# EAGLE design GadgetBox-Mini-Pro-Clone-Modules (EAGLE 6.6.0)

## Sheet 1 of 2
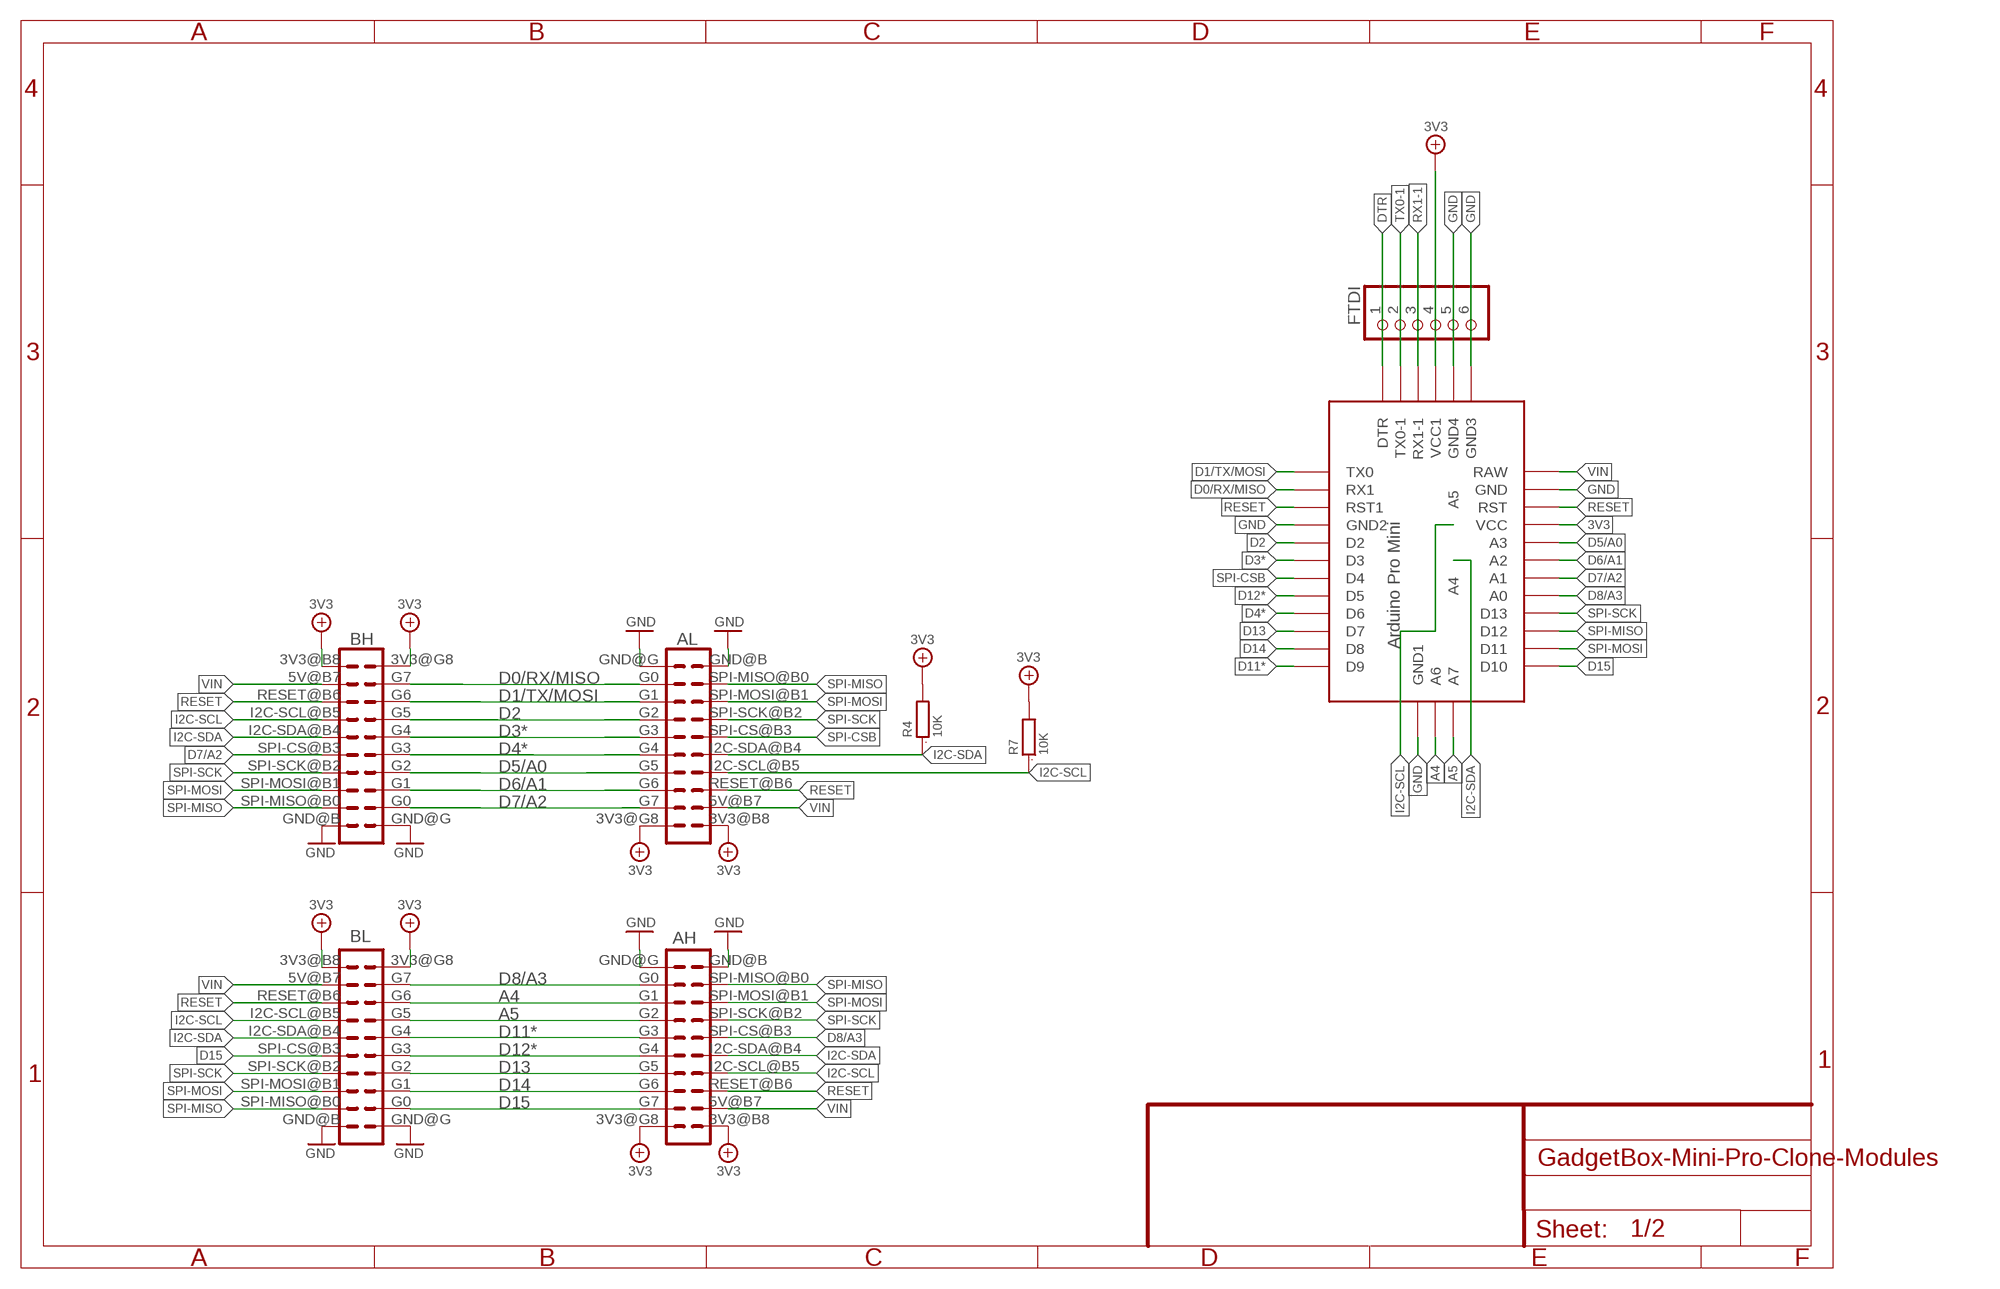
[diagram p0: schematic, sheet 1]

### Parts
AH  ECOGECOG_SLOT_ALT1  [ECOG_ALT1]
AL  ECOGECOG_SLOT_ALT1  [ECOG_ALT1]
BH  ECOGECOG_SLOT_ALT1  [ECOG_ALT1]
BL  ECOGECOG_SLOT_ALT1  [ECOG_ALT1]
FTDI  PINHD-1X6  [1X06]
R4  10K  R0603  [0603]
R7  10K  R0603  [0603]
U$1  ABK-PRO-MINI  [ABK-PRO-MINI]

### Nets
3V3: AH.3V3@B8(3V3) AH.3V3@G8(3V3) AL.3V3@B8(3V3) AL.3V3@G8(3V3) BH.3V3@B8(3V3) BH.3V3@G8(3V3) BL.3V3@B8(3V3) BL.3V3@G8(3V3) FTDI.4 R4.2 R7.2 U$1.VCC U$1.VCC11(VCC1)
A4: AH.G1 BL.G6 U$1.A6
A5: AH.G2 BL.G5 U$1.A7
D0/RX/MISO: AL.G0 BH.G7 U$1.RX1
D1/TX/MOSI: AL.G1 BH.G6 U$1.TX0
D2: AL.G2 BH.G5 U$1.D2
D3*: AL.G3 BH.G4 U$1.D3
D4*: AL.G4 BH.G3 U$1.D6
D5/A0: AL.G5 BH.G2 U$1.A3 ; also sheet 2
D6/A1: AL.G6 BH.G1 U$1.A2
D7/A2: AL.G7 BH.G0 BH.SPI-CS@B3(SPI-CS) U$1.A1
D8/A3: AH.G0 AH.SPI-CS@B3(SPI-CS) BL.G7 U$1.A0
D11*: AH.G3 BL.G4 U$1.D9
D12*: AH.G4 BL.G3 U$1.D5
D13: AH.G5 BL.G2 U$1.D7
D14: AH.G6 BL.G1 U$1.D8
D15: AH.G7 BL.G0 BL.SPI-CS@B3(SPI-CS) U$1.D10
DTR: FTDI.1 U$1.DTR
GND [gnd]: AH.GND@B(GND) AH.GND@G(GND) AL.GND@B(GND) AL.GND@G(GND) BH.GND@B(GND) BH.GND@G(GND) BL.GND@B(GND) BL.GND@G(GND) FTDI.5 FTDI.6 U$1.GND U$1.GND1 U$1.GND2 U$1.GND3 U$1.GND4 ; also sheet 2
I2C-SCL: AH.I2C-SCL@B5(I2C-SCL) AL.I2C-SCL@B5(I2C-SCL) BH.I2C-SCL@B5(I2C-SCL) BL.I2C-SCL@B5(I2C-SCL) R7.1 U$1.A5
I2C-SDA: AH.I2C-SDA@B4(I2C-SDA) AL.I2C-SDA@B4(I2C-SDA) BH.I2C-SDA@B4(I2C-SDA) BL.I2C-SDA@B4(I2C-SDA) R4.1 U$1.A4
RESET: AH.RESET@B6(RESET) AL.RESET@B6(RESET) BH.RESET@B6(RESET) BL.RESET@B6(RESET) U$1.RST U$1.RST1
RX1-1: FTDI.3 U$1.RX1-1
SPI-CSB: AL.SPI-CS@B3(SPI-CS) U$1.D4
SPI-MISO: AH.SPI-MISO@B0(SPI-MISO) AL.SPI-MISO@B0(SPI-MISO) BH.SPI-MISO@B0(SPI-MISO) BL.SPI-MISO@B0(SPI-MISO) U$1.D12
SPI-MOSI: AH.SPI-MOSI@B1(SPI-MOSI) AL.SPI-MOSI@B1(SPI-MOSI) BH.SPI-MOSI@B1(SPI-MOSI) BL.SPI-MOSI@B1(SPI-MOSI) U$1.D11
SPI-SCK: AH.SPI-SCK@B2(SPI-SCK) AL.SPI-SCK@B2(SPI-SCK) BH.SPI-SCK@B2(SPI-SCK) BL.SPI-SCK@B2(SPI-SCK) U$1.D13
TX0-1: FTDI.2 U$1.TX0-1
VIN: AH.5V@B7(5V) AL.5V@B7(5V) BH.5V@B7(5V) BL.5V@B7(5V) U$1.RAW ; also sheet 2

## Sheet 2 of 2
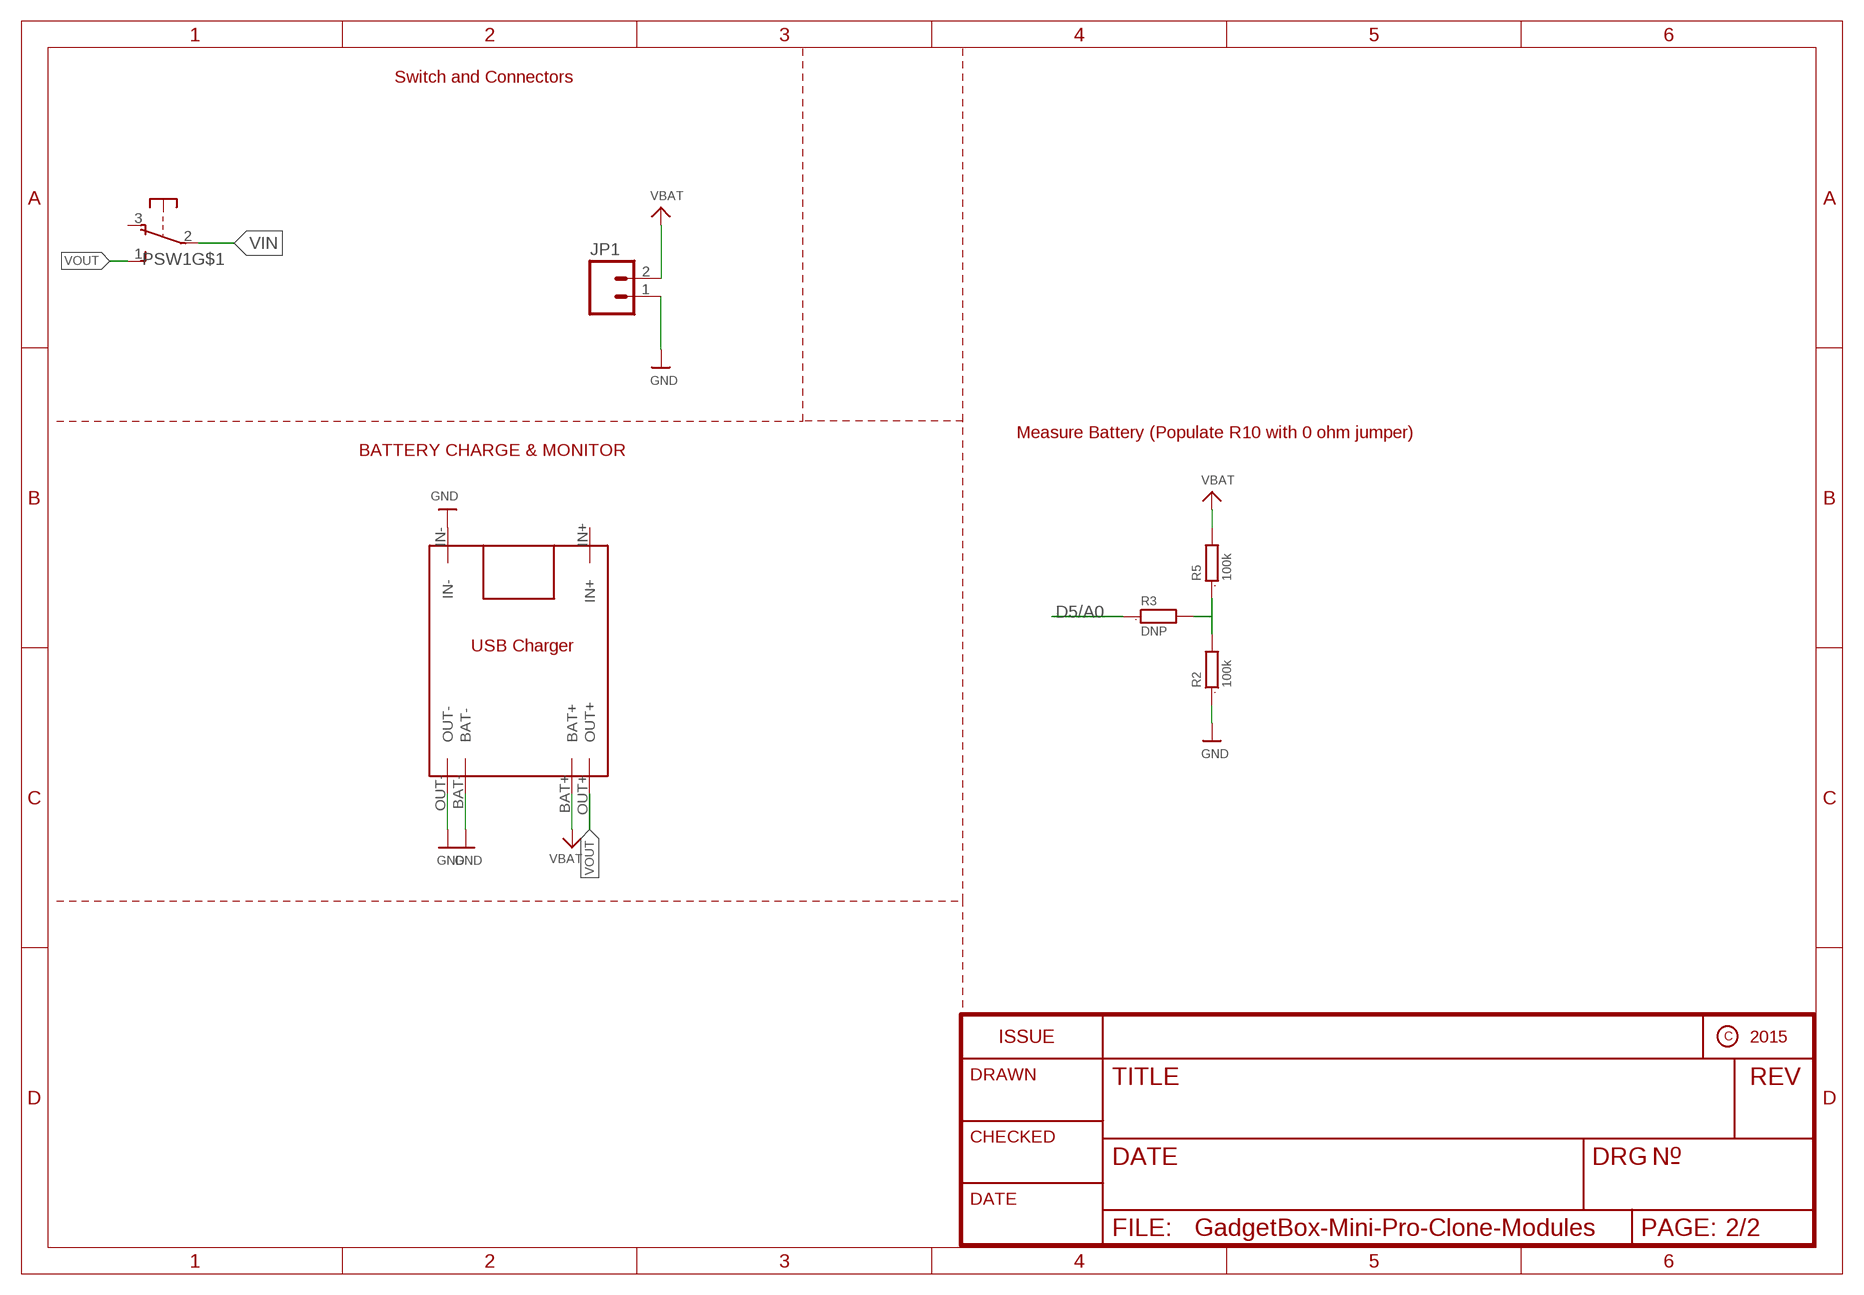
[diagram p1: schematic, sheet 2]

### Parts
JP1  M02-JST-2-PTH-NO_SILK  [JST-2-PTH-NS]
PSW1  OS102011MA1Q  [OS102011MA1Q]
R2  100k  R0603  [0603]
R3  DNP  R0603  [0603]
R5  100k  R0603  [0603]
U$5  TP4056  [TP4056]

### Nets
D5/A0: R3.1 ; also sheet 1
GND [gnd]: JP1.1 R2.1 U$5.BAT- U$5.IN- U$5.OUT- ; also sheet 1
N$2: R2.2 R3.2 R5.1
VBAT: JP1.2 R5.2 U$5.BAT+
VIN: PSW1.2(P) ; also sheet 1
VOUT: PSW1.1(S) U$5.OUT+
Unconnected: PSW1.3(O) PSW1.MT1(MT) PSW1.MT2(MT) U$5.IN+

### Notes on the sheet
- Switch and Connectors
- Measure Battery (Populate R10 with 0 ohm jumper)
- BATTERY CHARGE & MONITOR

## Library data of the parts
AH AL BH BL = eCogs:ECOG; PARTNO: PPPC102LFBN-RC,SULLINS CONNECTOR SOLUTIONS,dk,S6106-ND,"CONN HEADER FEM 20POS.1"" DL GOLD", REF67
FTDI = GadgetFactory:PINHD-1X6: PIN HEADER; PARTNO: PPPC061LGBN-RC,SULLINS CONNECTOR SOLUTIONS,dk,S5481-ND ,"6 Position Header Connector 0.100"" (2.54mm) Through Hole - Right Angle Gold ", REF91
JP1 = SparkFun:M02: Header 2 Standard 2-pin 0.1" header. Use with straight break away headers (SKU : PRT-00116), right angle break away headers (PRT-00553), swiss pins (PRT-00743), machine pins (PRT-00117), and female headers (PRT-00115). Molex polarized connector foot print use with SKU : PRT-08233 with associated crimp pins and housings.; PARTNO: B2B-PH-SM4-TB(LF)(SN),JST SALES AMERICA INC (VA),dk,455-1734-1-ND ,"2 Positions Header, Shrouded Connector 0.079 (2.00mm) Through Hole Tin ", REF87
PSW1 = adafruit:OS102011MA1Q: OS10201MA1Q through-hole right angle switch http://www.ladyada.net/library/eagle; PARTNO: OS102011MA1QN1,C&K Components,dk,CKN9559-ND,SWITCH SLIDE SPDT 100MA 12V , REF72
R2 R5 = GadgetFactory:R: RESISTOR, European symbol; PARTNO: RC0603JR-07100KL,YAGEO (VA),dk,311-100KGRCT-ND,RES SMD 100K OHM 5% 1/10W 0603 , REF76
R3 = GadgetFactory:R: RESISTOR, European symbol; BOM: EXCLUDE
R4 R7 = GadgetFactory:R: RESISTOR, European symbol; PARTNO: RC0603JR-0710KL,YAGEO (VA),dk,311-10KGRCT-ND,RES SMD 10K OHM 5% 1/10W 0603 , REF36
U$1 = Arduino-clone:ABK-PRO-MINI: ABK Pro-Mini Arduino Clone; BOM: EXCLUDE
U$5 = TP4056 charging module:TP4056

## Net classes
2 gnd: width 0.254 mm, drill 0.381 mm, clearance 0.254 mm
3 usbvcc: width 0.254 mm, drill 0.381 mm, clearance 0.254 mm
4 aref: width 0.254 mm, drill 0.381 mm, clearance 0.254 mm

## Board
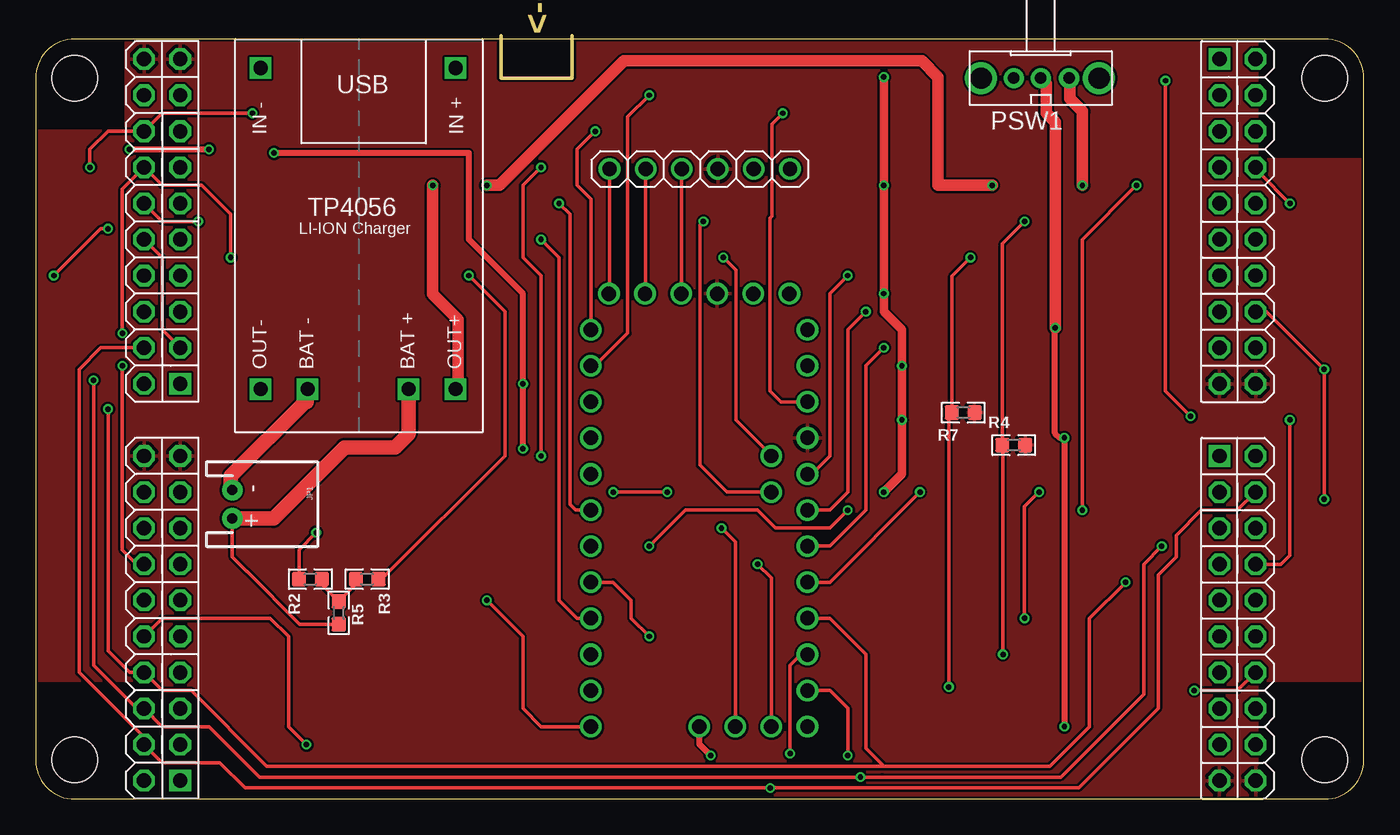
[diagram p2: board, top side]
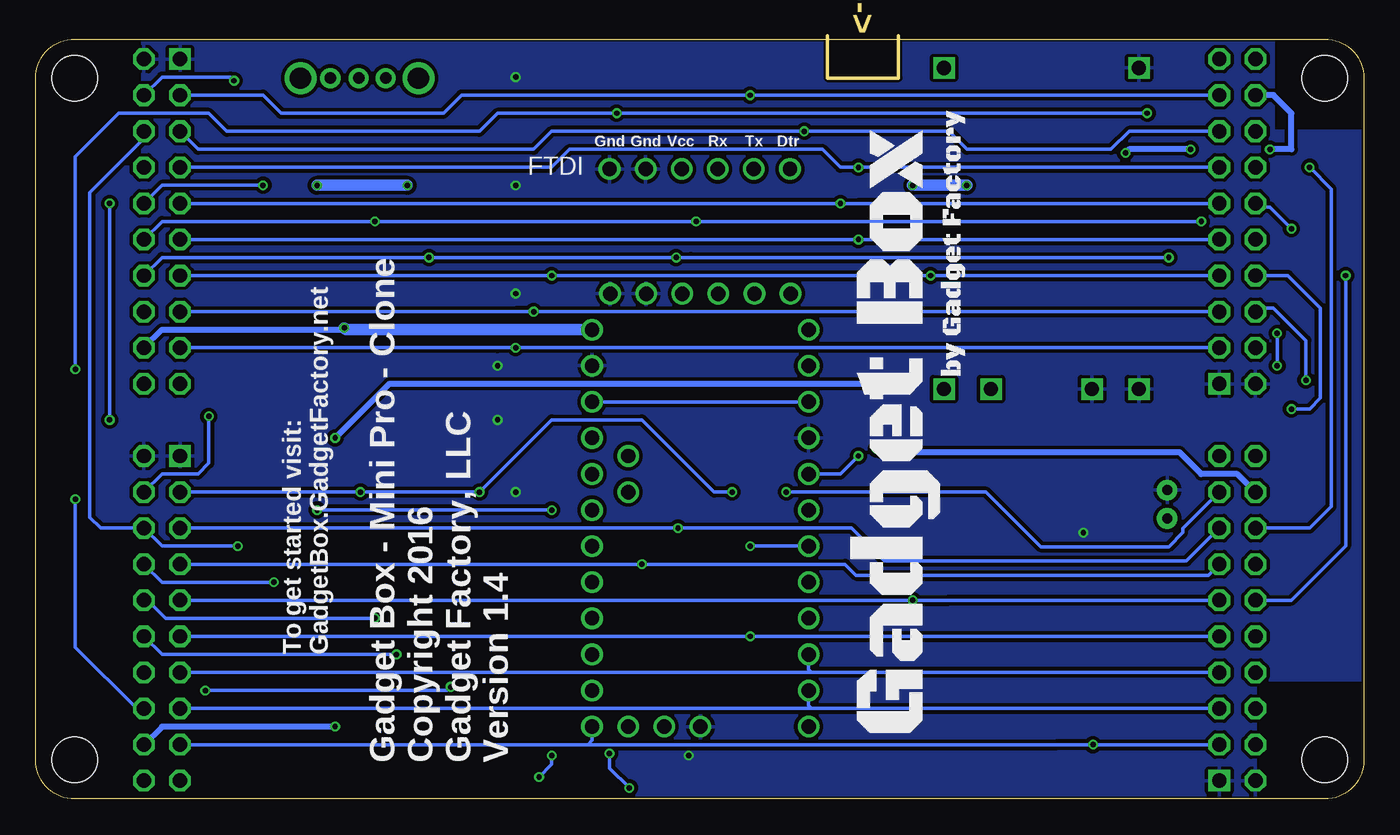
[diagram p3: board, bottom side, seen from below]

Size 93.5 x 53.75 mm. Coordinates in mm from the lower left corner, seen from the top.
Outline: 37.75,53.75 37.75,50.75 32.75,50.75 32.75,53.75
Copper layers (1*16): Top 0.035mm / dielectric 1.5mm / Bottom 0.035mm
Design rules "hackvana *": minimum track width 6mil, minimum drill 0.3mm, track to track 6mil, track to pad 6mil, pad to pad 6mil, via to via 6mil, smd to smd 0mil, copper to edge 6mil, drill to drill 6mil, minimum pad ring 10mil, minimum via ring 6mil, stop-mask expansion 2mil, vias tented up to drill 100mil, thermal gap 10mil

### Footprints (pad centres in the part's own frame; a part is rotated, then mirrored left to right if it is on the bottom)
ECOG93P53P5 = hole 3.2: 4,4; 92,4; 92,52; 4,52
ECOG_ALT1 = drill 1.016 octagon: 3V3@B8 21.59,3.81; 3V3@G8 21.59,1.27; 5V@B7 19.05,3.81; G0 1.27,1.27; G1 3.81,1.27; G2 6.35,1.27; G3 8.89,1.27; G4 11.43,1.27; G5 13.97,1.27; G6 16.51,1.27; G7 19.05,1.27; GND@B -1.27,3.81; I2C-SCL@B5 13.97,3.81; I2C-SDA@B4 11.43,3.81; RESET@B6 16.51,3.81; SPI-CS@B3 8.89,3.81; SPI-MISO@B0 1.27,3.81; SPI-MOSI@B1 3.81,3.81; SPI-SCK@B2 6.35,3.81 | drill 1.016 square: GND@G -1.27,1.27
1X06 = drill 1.016: 1 -6.35,0; 2 -3.81,0; 3 -1.27,0; 4 1.27,0; 5 3.81,0; 6 6.35,0
JST-2-PTH-NS = drill 0.7 pad 1.448: 1 -1,0; 2 1,0
OS102011MA1Q = drill 0.8 pad 1.422: 1 -2,0; 2 0,0; 3 1.9,0 | drill 1.5 pad 2.184: MT1 -4.1,0; MT2 4.2,0
0603 = smd 1 x 1: 1 -0.8,0; 2 0.8,0
ABK-PRO-MINI = drill 1.016: A0 10.16,-11.43; A1 10.16,-8.89; A2 10.16,-6.35; A3 10.16,-3.81; A4 7.62,-5.08; A5 7.62,-2.54; A6 5.08,-21.59; A7 7.62,-21.59; D2 -5.08,-3.81; D3 -5.08,-6.35; D4 -5.08,-8.89; D5 -5.08,-11.43; D6 -5.08,-13.97; D7 -5.08,-16.51; D8 -5.08,-19.05; D9 -5.08,-21.59; D10 10.16,-21.59; D11 10.16,-19.05; D12 10.16,-16.51; D13 10.16,-13.97; DTR -3.81,8.89; GND 10.16,3.81; GND1 -5.08,-1.27; GND2 8.89,8.89; GND3 6.35,8.89; GND4 2.54,-21.59; RAW 10.16,6.35; RST 10.16,1.27; RST1 -5.08,1.27; RX1 -5.08,3.81; RX1-1 1.27,8.89; TX0 -5.08,6.35; TX0-1 -1.27,8.89; VCC 10.16,-1.27; VCC11 3.81,8.89
TP4056 = drill 1 pad 1.422 square: BAT+ 3.505,-8.89; BAT- -3.607,-8.89; IN+ 6.807,13.716; IN- -6.909,13.716; OUT+ 6.807,-8.89; OUT- -6.909,-8.89

### Placement (x,y rotation side)
$$U$1  [ECOG93P53P5]  -1.25,-1.25 0 top
AH  82.06,22.88 270 top
AL  82.06,50.82 270 top
BH  11.45,30.5 90 top
BL  11.45,2.56 90 top
FTDI  46.75,44.35 0 top
JP1  13.85,20.75 270 top
PSW1  70.75,50.75 180 top
R2  19.34,15.48 0 top
R3  23.34,15.48 180 top
R4  68.85,24.91 0 top
R5  21.34,13.1 270 top
R7  65.3,27.2 0 top
U$1  44.17,26.69 0 top
U$5  22.75,37.75 0 top
U$100  [GADGETBOX_TEXT]  32.79,25.93 90 bottom

### Tracks (layer width: path | path; a pad name or v marks a point on that pad's centre or on a via)
3V3
  pour Top: -1.25,8.37 -1.25,47.03 6.37,47.03 6.37,54.63 85.95,54.63 85.95,45.01 94.92,45.01 94.92,8.37 85.95,8.37 85.95,-1.25 7.64,-1.25 7.64,8.37
A4  (via drill 0.38)
  Top 0.254: U$1.A6 49.25,18.1 v48.28,19.07
  Bottom 0.254: AH.G1 v48.28,19.07 36.07,19.07 33.75,16.75 12.5,16.75 BL.G6
A5  (via drill 0.38)
  Top 0.254: U$1.A7 51.79,15.56 v50.82,16.53
  Bottom 0.254: AH.G2 v50.82,16.53 36.53,16.53 35.75,15.75 10.96,15.75 BL.G5
D0/RX/MISO  (via drill 0.38)
  Top 0.254: U$1.RX1 39.39,30.5 41.68,32.79 41.68,48.03 v43.2,49.55
  Bottom 0.254: AL.G0 77.49,49.55 76.22,48.28 64.79,48.28 63.52,49.55 44.47,49.55 v43.2,49.55 BH.G7
D1/TX/MOSI  (via drill 0.38)
  Top 0.254: U$1.TX0 39.09,42.23 38.12,43.2 38.12,45.74 v39.39,47.01
  Bottom 0.254: BH.G6 16.53,47.01 17.8,45.74 27.96,45.74 29.23,47.01 v39.39,47.01 57.17,47.01 58.44,45.74 82.06,45.74 AL.G1
D2  (via drill 0.38)
  Top 0.254: v35.58,24.15 35.58,36.85 34.31,38.12 34.31,43.2 v35.58,44.47
  Bottom 0.254: AL.G2 57.17,44.47 55.9,45.74 38.12,45.74 36.85,44.47 v35.58,44.47 BH.G5 | U$1.D2 36.85,22.88 v35.58,24.15
D3*  (via drill 0.38)
  Top 0.254: U$1.D3 37.99,20.34 37.61,20.72 37.61,41.17 v36.85,41.93
  Bottom 0.254: BH.G4 35.58,41.93 v36.85,41.93 AL.G3
D4*  (via drill 0.38)
  Top 0.254: U$1.D6 38.12,12.72 36.85,13.99 36.85,38.12 v35.58,39.39
  Bottom 0.254: AL.G4 v35.58,39.39 34.31,39.39 BH.G3
D5/A0  (via drill 0.38)
  Top 0.254: U$1.A3 54.63,22.88 55.9,24.15 55.9,35.58 v57.17,36.85 | R3.1 24.37,15.48 33.04,24.15 33.04,34.31 v30.5,36.85
  Bottom 0.254: AL.G5 v57.17,36.85 v30.5,36.85 29.23,36.85 BH.G2
D6/A1  (via drill 0.38)
  Top 0.254: U$1.A2 55.9,20.34 57.17,21.61 57.17,33.04 v58.44,34.31
  Bottom 0.254: AL.G6 59.71,34.31 v58.44,34.31 BH.G1
D7/A2  (via drill 0.38)
  Top 0.254: U$1.A1 55.9,17.8 58.44,20.34 58.44,30.5 v59.71,31.77 | BH.G0 8.91,33.04 8.91,38.12 BH.SPI-CS@B3
  Bottom 0.254: BH.G0 v59.71,31.77 60.98,31.77 AL.G7
D8/A3  (via drill 0.38)
  Top 0.254: v69.62,12.72 69.62,20.59 v70.63,21.61 | U$1.A0 55.9,15.26 v62.25,21.61 | v40.66,21.61 v44.47,21.61
  Bottom 0.254: AH.G0 v70.63,21.61 v62.25,21.61 57.17,26.69 50.82,26.69 45.74,21.61 v44.47,21.61 | AH.SPI-CS@B3 85.62,13.99 84.35,12.72 v69.62,12.72 | v40.66,21.61 26.61,21.61 22.75,17.75 13.75,17.75 12.75,18.75 12.75,19.04 BL.G7
D11*  (via drill 0.38)
  Top 0.254: U$1.D9 35.58,5.1 34.31,6.37 34.31,11.45 v31.77,13.99
  Bottom 0.254: BL.G4 29.23,13.99 v31.77,13.99 AH.G3
D12*  (via drill 0.38)
  Top 0.254: U$1.D5 40.66,15.26 41.93,13.99 41.93,12.72 v43.2,11.45
  Bottom 0.254: AH.G4 44.47,11.45 v43.2,11.45 BL.G3
D13
  Bottom 0.254: BL.G2 38.88,8.91 | 38.88,8.91 AH.G5 | U$1.D7 39.09,9.12 38.88,8.91
D14
  Bottom 0.254: AH.G6 38.88,6.37 | 38.88,6.37 BL.G1 | U$1.D8 39.09,6.58 38.88,6.37
D15  (via drill 0.38)
  Top 0.254: BL.SPI-CS@B3 8.91,12.72 16.53,12.72 17.8,11.45 17.8,5.1 v19.07,3.83
  Bottom 0.254: AH.G7 54.63,3.83 | 54.63,3.83 21.61,3.83 v19.07,3.83 BL.G0 | U$1.D10 54.33,4.13 54.63,3.83
DTR
  Top 0.254: FTDI.1 40.4,35.62 U$1.DTR
GND  (via drill 0.38)
  Top 0.254: R2.1 18.54,17.54 v19.75,18.75
  Top 0.406: U$1.GND4 46.71,3.88 v47.52,3.07
  Top 0.61: v59.71,50.82 v59.71,43.2 v59.71,35.58 59.71,34.31 60.98,33.04 v60.98,30.5 v60.98,26.69 60.98,22.88 v59.71,21.61
  Top 1.016: U$5.BAT- 19.07,28.79 19.07,27.96 18.96,27.96 13.75,22.75 13.75,21.85 JP1.1
  pour Bottom: -1.25,8.4 -1.25,47.01 6.37,47.01 6.37,55.14 85.95,55.14 85.95,44.47 94.92,44.47 94.92,8.91 85.95,8.91 85.95,-1.76 7.64,-1.76 7.64,8.4
I2C-SCL  (via drill 0.38)
  Top 0.254: v13.74,38.12 13.74,41.17 11.7,43.2 8.91,43.2 BH.I2C-SCL@B5 6.12,42.95 v6.12,32.79 | BL.I2C-SCL@B5 7.13,16.53 6.12,17.55 v6.12,30.5 | AH.I2C-SCL@B5 84.6,7.64 v81.55,7.64 | v65.81,38.12 64.5,36.81 R7.1 64.28,26.98 v64.28,7.89 | U$1.A5 51.79,24.2 49.3,26.69 49.3,37.23 v48.41,38.12
  Bottom 0.254: AL.I2C-SCL@B5 84.6,38.12 v65.81,38.12 v48.41,38.12 47.39,38.12 v13.74,38.12 | v6.12,30.5 v6.12,32.79 | v81.55,7.64 64.54,7.64 v64.28,7.89
I2C-SDA  (via drill 0.38)
  Top 0.254: v68.09,10.18 68.09,24.87 R4.1 68.05,39.1 v69.62,40.66 | U$1.A4 48.66,21.61 46.76,23.52 46.76,40.41 v47.01,40.66 | BH.I2C-SDA@B4 8.91,40.66 v11.45,40.66 | v5.1,40.15 4.59,40.15 v1.29,36.85
  Bottom 0.254: AL.I2C-SDA@B4 84.6,40.66 v69.62,40.66 48.28,40.66 v47.01,40.66 v11.45,40.66 | BL.I2C-SDA@B4 5.1,13.99 1.29,17.8 v1.29,36.85 | v5.1,40.15 6.62,41.68 7.39,41.68 BH.I2C-SDA@B4 | AH.I2C-SDA@B4 84.6,10.18 v68.09,10.18
N$2
  Top 0.254: R3.2 22.54,15.1 R5.1 20.14,15.1 R2.2
RESET  (via drill 0.38)
  Top 0.254: v52.6,48.28 51.84,47.52 51.84,41.02 51.71,40.9 51.71,28.72 52.47,27.96 U$1.RST | v90.7,21.1 v90.7,30.25 86.63,34.31 AL.RESET@B6 | v15.26,48.28 8.91,48.28 BH.RESET@B6 5.1,47.01 3.83,45.74 v3.83,44.47
  Bottom 0.254: v15.26,48.28 v52.6,48.28 60.98,48.28 62.25,47.01 80.03,47.01 81.3,48.28 87.65,48.28 90.7,45.23 v90.7,30.25 | v90.7,21.1 90.7,10.69 86.38,6.37 AH.RESET@B6 | U$1.RST1 U$1.RST | BL.RESET@B6 3.83,19.07 2.31,20.59 2.31,42.95 v3.83,44.47
RX1-1
  Top 0.254: FTDI.3 45.48,35.62 U$1.RX1-1
SPI-CSB  (via drill 0.38)
  Top 0.254: v57.17,20.34 55.9,19.07 52.09,19.07 50.82,20.34 45.74,20.34 43.84,18.43 v43.2,17.8 | v73.68,20.34 73.68,39.39 v77.49,43.2
  Bottom 0.254: v57.17,20.34 v73.68,20.34 | v77.49,43.2 84.6,43.2 AL.SPI-CS@B3 | U$1.D4 v43.2,17.8
SPI-MISO  (via drill 0.38)
  Top 0.254: AH.SPI-MISO@B0 84.6,20.34 82.06,20.34 80.28,18.56 80.28,17.04 79.01,15.77 79.01,6.37 73.43,0.78 v51.71,0.78 50.57,0.78 14.75,0.78 12.97,2.56 8.91,2.56 BL.SPI-MISO@B0 7.64,4.34 3.07,8.91 3.07,30.25 4.59,31.77 BH.SPI-MISO@B0 | v79.52,50.57 79.52,28.72 v81.3,26.94 | U$1.D12 53.87,10.18 53.11,9.42 v53.11,3.2
  Bottom 0.254: AL.SPI-MISO@B0 84.6,50.82 79.78,50.82 v79.52,50.57 | v81.3,26.94 81.3,23.64 82.06,22.88 84.6,22.88 AH.SPI-MISO@B0 | v53.11,3.2 53.11,2.18 v51.71,0.78
SPI-MOSI  (via drill 0.38)
  Top 0.254: v79.27,17.8 78,16.53 78,7.39 72.16,1.54 59.58,1.54 v58.06,1.54 15.77,1.54 12.21,5.1 8.91,5.1 BL.SPI-MOSI@B1 7.13,6.37 4.08,9.42 v4.08,29.48 | U$1.D11 55.9,7.64 57.17,6.37 v57.17,3.07
  Bottom 0.254: v79.27,17.8 84.6,17.8 AH.SPI-MOSI@B1 88.92,19.07 89.68,19.83 89.68,42.69 85.87,46.5 AL.SPI-MOSI@B1 | v4.08,29.48 4.08,32.28 6.37,34.56 7.39,34.56 BH.SPI-MOSI@B1 | v57.17,3.07 57.17,2.43 v58.06,1.54
SPI-SCK  (via drill 0.38)
  Top 0.254: 59.71,2.31 16.28,2.31 10.94,7.64 8.91,7.64 BL.SPI-SCK@B2 6.62,8.91 5.1,10.43 v5.1,27.45 | 59.71,2.31 71.39,2.31 74.19,5.1 74.19,12.72 v76.73,15.26 | AL.SPI-SCK@B2 86.13,44.47 86.13,44.09 v88.28,41.93 | AH.SPI-SCK@B2 87.65,16.53 88.28,17.16 v88.28,26.69 | U$1.D13 55.9,12.72 58.44,10.18 58.44,3.58 59.71,2.31
  Bottom 0.254: v76.73,15.26 84.6,15.26 AH.SPI-SCK@B2 | v5.1,27.45 3.83,27.45 3.07,28.21 3.07,34.56 5.35,36.85 BH.SPI-SCK@B2 | v88.28,41.93 v88.28,26.69
TX0-1
  Top 0.254: FTDI.2 42.94,35.62 U$1.TX0-1
VBAT
  Top 0.254: 21.29,12.25 R5.2 18.6,12.3 14.88,16.02 13.85,17.05 JP1.2
  Top 1.016: U$5.BAT+ 26.25,25.7 25.3,24.75 21.75,24.75 16.75,19.75 JP1.2
VIN  (via drill 0.38)
  Top 0.406: v6.62,45.74 v12.21,45.74 | v16.78,45.49 30.5,45.49 30.5,39.39 34.31,35.58 v34.31,29.23 v34.31,24.66 | v72.41,5.1 v72.41,25.42 72.08,25.42 71.75,25.75 71.75,33.14 v71.78,33.17
  Top 0.813: v71.78,33.17 71.78,47.65 71.14,48.28 71.14,50.36 PSW1.2
  Bottom 0.406: v6.62,45.74 5.1,45.74 5.1,48.28 6.37,49.55 BH.5V@B7 | v12.21,45.74 16.53,45.74 v16.78,45.49 | v34.31,29.23 68.6,29.23 v72.41,25.42 | BL.5V@B7 8.91,22.88 11.45,22.88 12.97,24.4 34.06,24.4 v34.31,24.66 | v72.41,5.1 84.6,5.1 AH.5V@B7 | AL.5V@B7 84.6,33.04 71.9,33.04 v71.78,33.17
  Bottom 0.813: U$1.RAW 71.65,33.04 v71.78,33.17
VOUT  (via drill 0.38)
  Top 0.813: v27.96,43.2 27.96,35.54 29.75,33.75 29.75,29.05 U$5.OUT+ | v31.77,43.2 32.66,43.2 41.42,51.96 62.38,51.96 63.52,50.82 63.52,43.2 v67.33,43.2 | v73.68,43.2 73.68,48.41 72.79,49.3 72.79,50.71 PSW1.1
  Bottom 0.813: v27.96,43.2 v31.77,43.2 | v67.33,43.2 v73.68,43.2

### Text on the board
Dimension: <---Cutout
bPlace: Dtr | Tx | Rx | Vcc | Gnd | Gnd | To get started visit: / GadgetBox.GadgetFactory.net | Gadget Box - Mini Pro - Clone / Copyright 2016 / Gadget Factory, LLC / Version 1.4
Reference: TOP Silkscreen is on layer 200